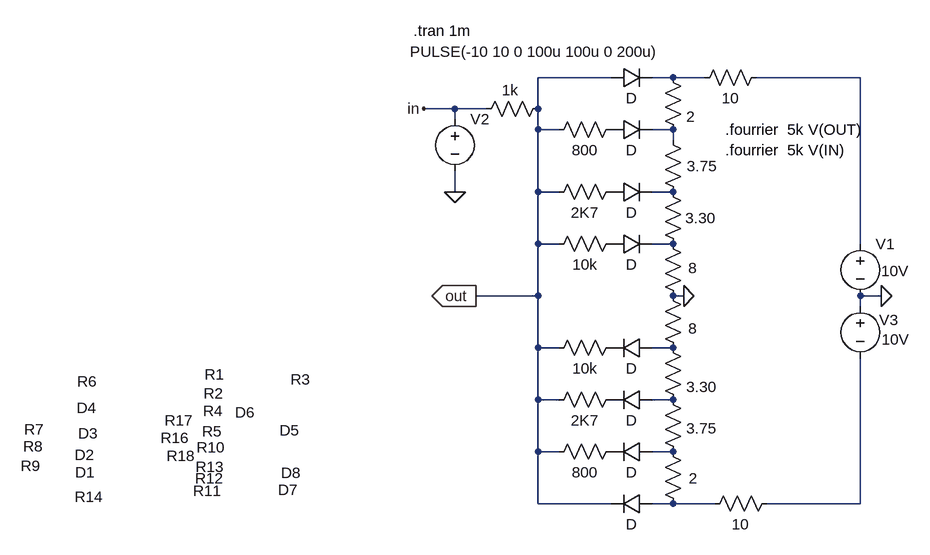
[diagram p0: schematic diode_conformateur.asc]
diode_conformateur.asc, the LTspice schematic file:
Version 4
SHEET 1 880 836
WIRE -16 112 -128 112
WIRE 80 112 48 112
WIRE 128 112 80 112
WIRE 368 112 208 112
WIRE -256 160 -304 160
WIRE -208 160 -256 160
WIRE -128 160 -128 112
WIRE -256 176 -256 160
WIRE -128 192 -128 160
WIRE -96 192 -128 192
WIRE 80 192 48 192
WIRE 80 208 80 192
WIRE -256 288 -256 256
WIRE -128 288 -128 192
WIRE -96 288 -128 288
WIRE 80 288 48 288
WIRE -128 368 -128 288
WIRE -96 368 -128 368
WIRE 80 368 48 368
WIRE 368 368 368 112
WIRE -128 448 -128 368
WIRE -128 448 -224 448
WIRE 96 448 80 448
WIRE 400 448 368 448
WIRE 368 464 368 448
WIRE -128 528 -128 448
WIRE -96 528 -128 528
WIRE 80 528 48 528
WIRE -128 608 -128 528
WIRE -96 608 -128 608
WIRE 80 608 48 608
WIRE -128 688 -128 608
WIRE -96 688 -128 688
WIRE 80 688 48 688
WIRE -128 768 -128 688
WIRE -16 768 -128 768
WIRE 80 768 48 768
WIRE 144 768 80 768
WIRE 368 768 368 544
WIRE 368 768 224 768
FLAG 400 448 0
FLAG -256 288 0
FLAG -224 448 out
IOPIN -224 448 Out
FLAG -304 160 in
FLAG 96 448 0
SYMBOL voltage 368 352 R0
WINDOW 123 0 0 Left 0
WINDOW 39 0 0 Left 0
WINDOW 3 32 58 Left 0
SYMATTR InstName V1
SYMATTR Value 10V
SYMBOL res -112 144 R90
WINDOW 0 448 382 VBottom 0
WINDOW 3 -28 59 VTop 0
SYMATTR InstName R3
SYMATTR Value 1k
SYMBOL voltage -256 160 R0
WINDOW 123 0 0 Left 0
WINDOW 39 0 0 Left 0
WINDOW 3 -69 -88 Left 0
SYMATTR InstName V2
SYMATTR Value PULSE(-10 10 0 100u 100u 0 200u)
SYMBOL diode -16 128 R270
WINDOW 0 -607 -809 VTop 0
WINDOW 3 0 32 VBottom 0
SYMATTR InstName D1
SYMBOL diode -16 208 R270
WINDOW 0 -500 -810 VTop 0
WINDOW 3 0 32 VBottom 0
SYMATTR InstName D2
SYMBOL diode -16 304 R270
WINDOW 0 -371 -805 VTop 0
WINDOW 3 0 32 VBottom 0
SYMATTR InstName D3
SYMBOL diode -16 384 R270
WINDOW 0 -252 -807 VTop 0
WINDOW 3 0 32 VBottom 0
SYMATTR InstName D4
SYMBOL res 64 96 R0
WINDOW 0 -705 473 Left 0
SYMATTR InstName R1
SYMATTR Value 2
SYMBOL res 64 192 R0
WINDOW 0 -707 406 Left 0
WINDOW 3 37 56 Left 0
SYMATTR InstName R2
SYMATTR Value 3.75
SYMBOL res 64 272 R0
WINDOW 0 -708 353 Left 0
WINDOW 3 35 56 Left 0
SYMATTR InstName R4
SYMATTR Value 3.30
SYMBOL res 64 352 R0
WINDOW 0 -709 305 Left 0
WINDOW 3 39 53 Left 0
SYMATTR InstName R5
SYMATTR Value 8
SYMBOL res 224 96 R90
WINDOW 0 499 1046 VBottom 0
WINDOW 3 32 56 VTop 0
SYMATTR InstName R6
SYMATTR Value 10
SYMBOL res 0 176 R90
WINDOW 0 493 904 VBottom 0
WINDOW 3 32 56 VTop 0
SYMATTR InstName R7
SYMATTR Value 800
SYMBOL res 0 272 R90
WINDOW 0 423 905 VBottom 0
WINDOW 3 32 56 VTop 0
SYMATTR InstName R8
SYMATTR Value 2K7
SYMBOL res 0 352 R90
WINDOW 0 373 909 VBottom 0
WINDOW 3 32 56 VTop 0
SYMATTR InstName R9
SYMATTR Value 10k
SYMBOL res 64 432 R0
WINDOW 0 -718 249 Left 0
WINDOW 3 39 66 Left 0
SYMATTR InstName R10
SYMATTR Value 8
SYMBOL res 64 512 R0
WINDOW 0 -723 236 Left 0
SYMATTR InstName R11
SYMATTR Value 3.30
SYMBOL res 64 592 R0
WINDOW 0 -720 137 Left 0
WINDOW 3 36 60 Left 0
SYMATTR InstName R12
SYMATTR Value 3.75
SYMBOL res 64 672 R0
WINDOW 0 -719 39 Left 0
WINDOW 3 40 57 Left 0
SYMATTR InstName R13
SYMATTR Value 2
SYMBOL res 240 752 R90
WINDOW 0 21 1059 VBottom 0
WINDOW 3 32 56 VTop 0
SYMATTR InstName R14
SYMATTR Value 10
SYMBOL voltage 368 448 R0
WINDOW 123 0 0 Left 0
WINDOW 39 0 0 Left 0
WINDOW 0 29 37 Left 0
WINDOW 3 33 67 Left 0
SYMATTR InstName V3
SYMATTR Value 10V
SYMBOL diode 48 512 R90
WINDOW 0 159 559 VBottom 0
WINDOW 3 32 32 VTop 0
SYMATTR InstName D5
SYMBOL diode 48 592 R90
WINDOW 0 51 627 VBottom 0
WINDOW 3 32 32 VTop 0
SYMATTR InstName D6
SYMBOL res 0 592 R90
WINDOW 0 90 687 VBottom 0
WINDOW 3 32 56 VTop 0
SYMATTR InstName R16
SYMATTR Value 2K7
SYMBOL diode 48 672 R90
WINDOW 0 64 556 VBottom 0
WINDOW 3 32 32 VTop 0
SYMATTR InstName D8
SYMBOL diode 48 752 R90
WINDOW 0 10 561 VBottom 0
WINDOW 3 32 32 VTop 0
SYMATTR InstName D7
SYMBOL res 0 512 R90
WINDOW 0 143 681 VBottom 0
WINDOW 3 32 56 VTop 0
SYMATTR InstName R17
SYMATTR Value 10k
SYMBOL res 0 672 R90
WINDOW 0 38 678 VBottom 0
WINDOW 3 32 56 VTop 0
SYMATTR InstName R18
SYMATTR Value 800
TEXT -320 40 Left 0 !.tran 1m
TEXT 160 192 Left 0 !.fourrier  5k V(OUT)\n.fourrier  5k V(IN)

The netlist it stands for:
* diode_conformateur.asc
V1 N002 0 10V
R3 out in 1k
V2 in 0 PULSE(-10 10 0 100u 100u 0 200u)
D1 out N001 D
D2 P001 N003 D
D3 P002 N004 D
D4 P003 N005 D
R1 N001 N003 2
R2 N003 N004 3.75
R4 N004 N005 3.30
R5 N005 0 8
R6 N002 N001 10
R7 P001 out 800
R8 P002 out 2K7
R9 P003 out 10k
R10 0 N006 8
R11 N006 N007 3.30
R12 N007 N008 3.75
R13 N008 N009 2
R14 N010 N009 10
V3 0 N010 10V
D5 N006 P004 D
D6 N007 P005 D
R16 P005 out 2K7
D8 N008 P006 D
D7 N009 out D
R17 P004 out 10k
R18 P006 out 800
.model D D
.lib standard.dio
.tran 1m
.fourrier  5k V(OUT)
.fourrier  5k V(IN)
.backanno
.end